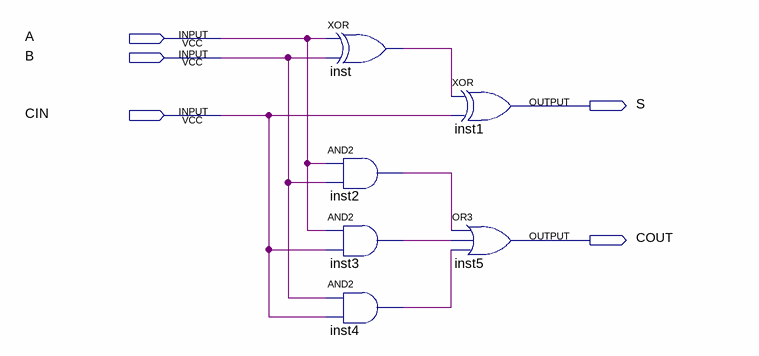
[diagram p0: schematic sheet]
// Quartus schematic FA.bdf as structural Verilog: 6 symbols, 5 pins
module FA (
  input  A,
  input  B,
  input  CIN,
  output S,
  output COUT
);

  wire inst2_out, inst3_out, inst4_out, inst_out;

  xor inst (inst_out, A, B);
  and inst2 (inst2_out, A, B);
  and inst3 (inst3_out, A, CIN);
  and inst4 (inst4_out, B, CIN);
  xor inst1 (S, inst_out, CIN);
  or inst5 (COUT, inst2_out, inst3_out, inst4_out);
endmodule
